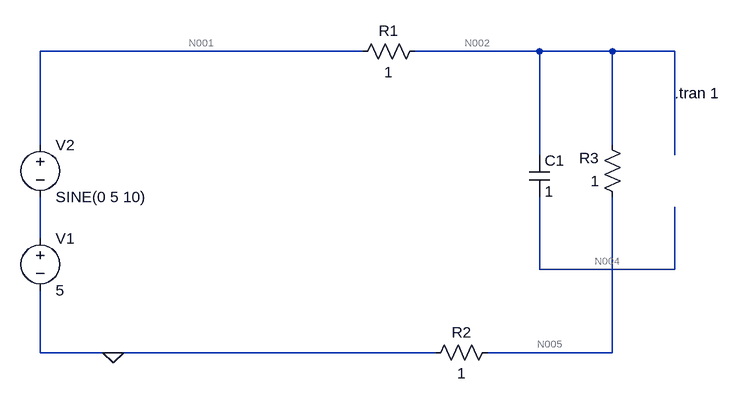
[diagram p0: schematic TRAN_V-Sine_V_DC_R+(R__C)+R.asc]
TRAN_V-Sine_V_DC_R+(R__C)+R.asc, the LTspice schematic file:
Version 4
SHEET 1 924 680
WIRE 368 64 -128 64
WIRE 640 64 448 64
WIRE 752 64 640 64
WIRE 848 64 752 64
WIRE -128 208 -128 64
WIRE 752 208 752 64
WIRE 640 224 640 64
WIRE 848 224 848 64
WIRE -128 352 -128 288
WIRE 640 400 640 288
WIRE 848 400 848 304
WIRE 848 400 640 400
WIRE -128 528 -128 432
WIRE -16 528 -128 528
WIRE 480 528 -16 528
WIRE 752 528 752 288
WIRE 752 528 560 528
FLAG -16 528 0
SYMBOL voltage -128 336 R0
SYMATTR InstName V1
SYMATTR Value 5
SYMBOL voltage -128 192 R0
SYMATTR InstName V2
SYMATTR Value SINE(0 5 10)
SYMBOL res 464 48 R90
WINDOW 0 0 56 VBottom 2
WINDOW 3 32 56 VTop 2
SYMATTR InstName R1
SYMATTR Value 1
SYMBOL res 576 512 R90
WINDOW 0 0 56 VBottom 2
WINDOW 3 32 56 VTop 2
SYMATTR InstName R2
SYMATTR Value 1
SYMBOL res 768 304 R180
WINDOW 0 36 76 Left 2
WINDOW 3 36 40 Left 2
SYMATTR InstName R3
SYMATTR Value 1
SYMBOL cap 624 224 R0
SYMATTR InstName C1
SYMATTR Value 1
TEXT 848 128 Left 2 !.tran 1

The netlist it stands for:
* TRAN_V-Sine_V_DC_R+(R__C)+R.asc
V1 N003 0 5
V2 N001 N003 SINE(0 5 10)
R1 N002 N001 1
R2 N005 0 1
R3 N005 N002 1
C1 N002 N004 1
.tran 1
.backanno
.end

* Results of the author's LTspice run, read from the files saved beside the schematic
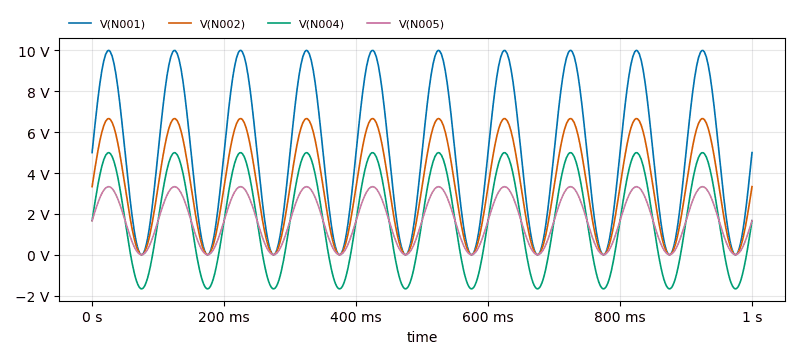
[diagram p1: Transient Analysis of TRAN_V-Sine_V_DC_R+(R__C)+R.asc, plotted from the saved traces]
* Transient Analysis, 1 run:
*   V(N001): min 51.18 µV, max 9.998 V, average 4.996 V, rms 6.126 V, last 5 V
*   V(N002): min 3.171 mV, max 6.662 V, average 3.331 V, rms 4.083 V, last 3.333 V
*   V(N004): min -1.663 V, max 4.995 V, average 1.664 V, rms 2.889 V, last 1.667 V
*   V(N005): min 1.585 mV, max 3.331 V, average 1.665 V, rms 2.041 V, last 1.667 V